# EAGLE design Dual-Port_microSD_Shield_USB2241 (EAGLE 9.6.2)
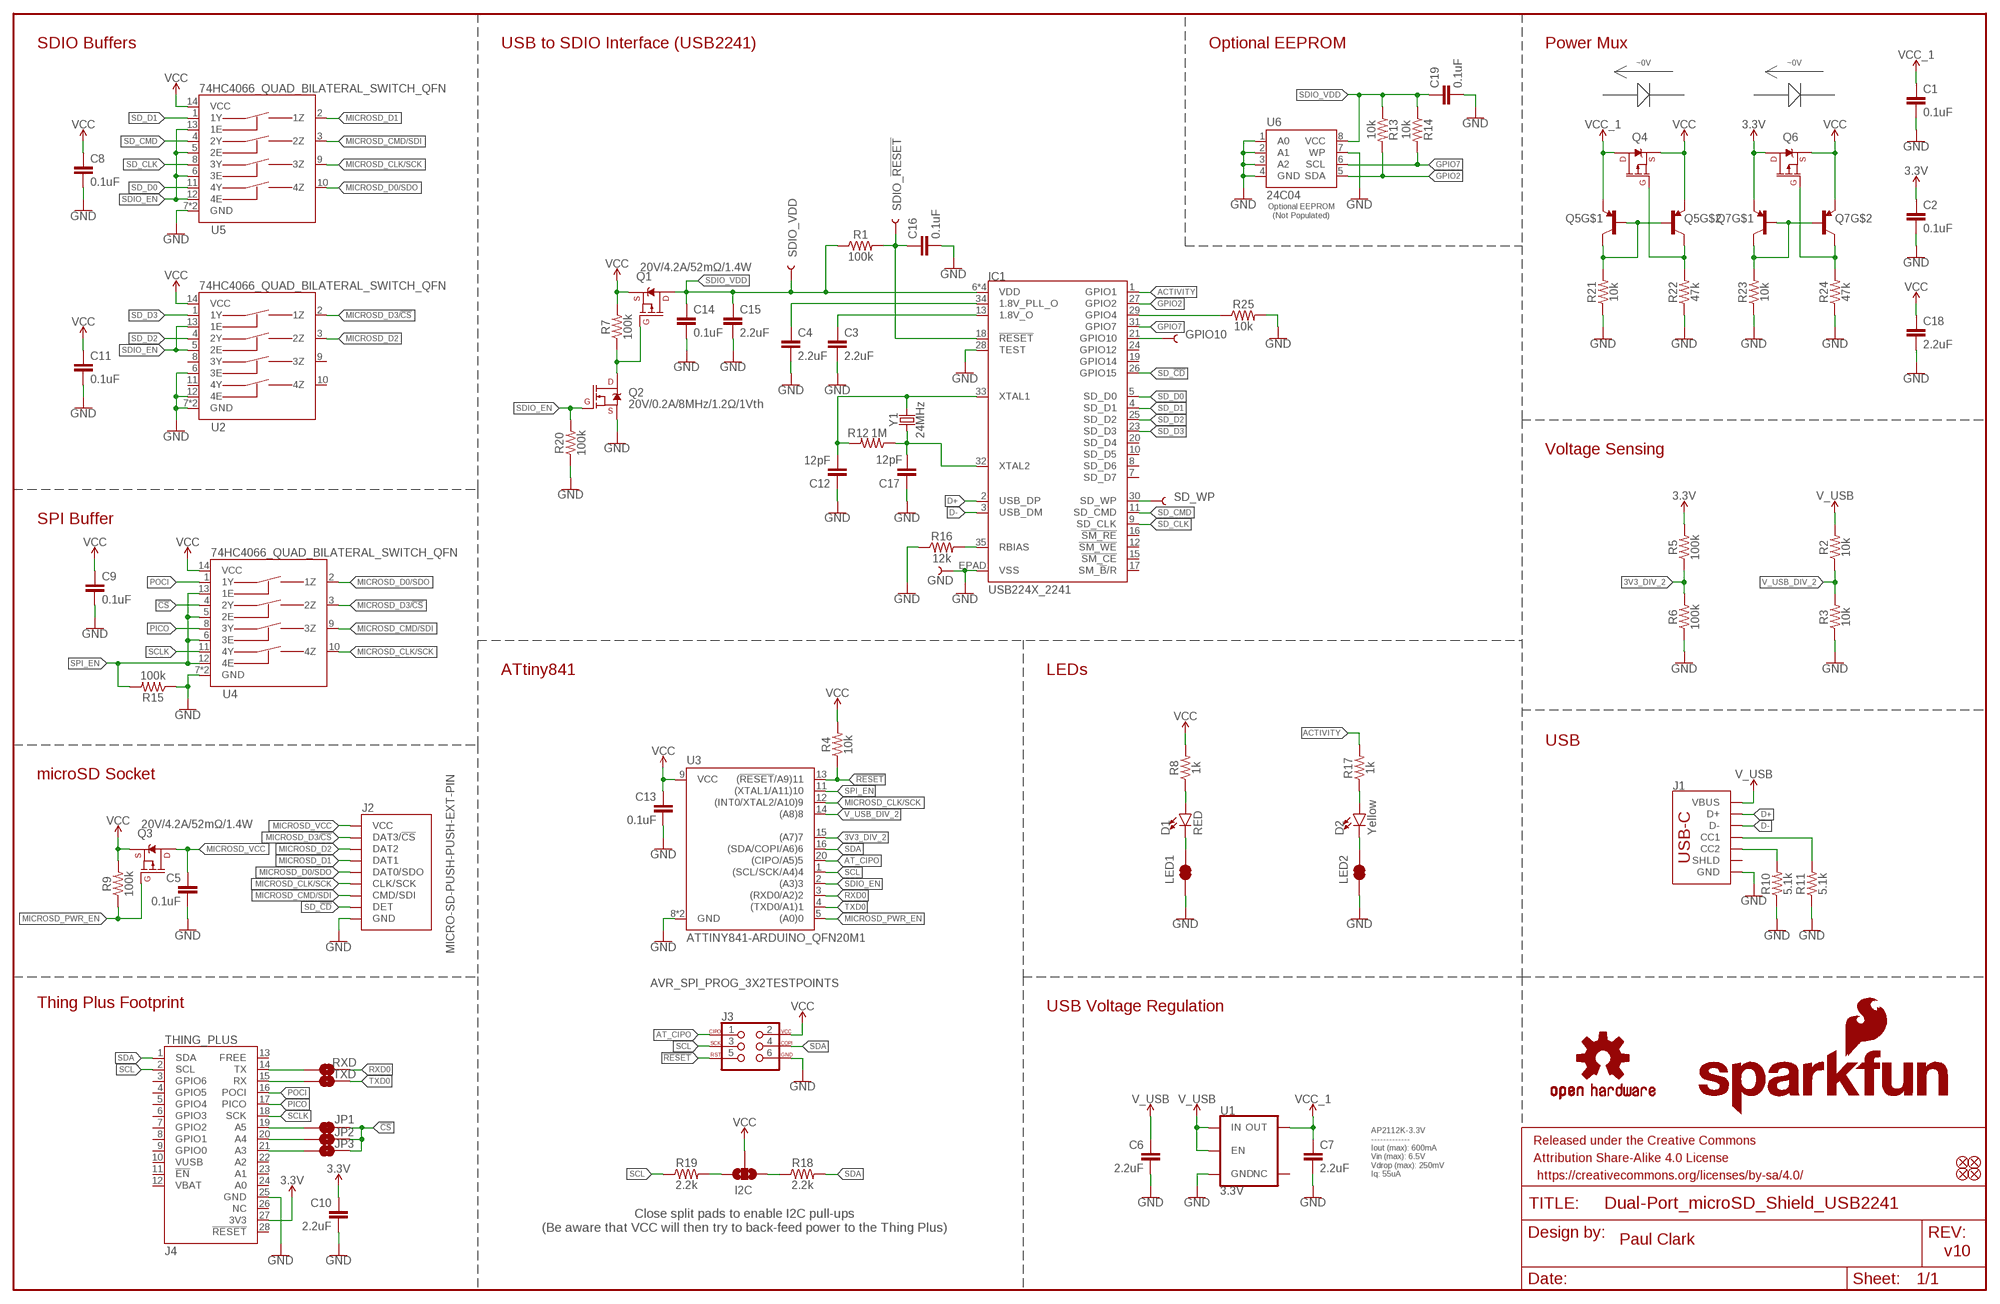
[diagram p0: schematic, sheet 1]

## Parts
C1  0.1uF  0.1UF-0402T-6.3V-10%-X7R  [0402-TIGHT]
C2  0.1uF  0.1UF-0402T-6.3V-10%-X7R  [0402-TIGHT]
C3  2.2uF  2.2UF-0402_TIGHT-10V-10%-X5R  [0402-TIGHT]
C4  2.2uF  2.2UF-0402_TIGHT-10V-10%-X5R  [0402-TIGHT]
C5  0.1uF  0.1UF-0402T-6.3V-10%-X7R  [0402-TIGHT]
C6  2.2uF  2.2UF-0402_TIGHT-10V-10%-X5R  [0402-TIGHT]
C7  2.2uF  2.2UF-0402_TIGHT-10V-10%-X5R  [0402-TIGHT]
C8  0.1uF  0.1UF-0402T-6.3V-10%-X7R  [0402-TIGHT]
C9  0.1uF  0.1UF-0402T-6.3V-10%-X7R  [0402-TIGHT]
C10  2.2uF  2.2UF-0402_TIGHT-10V-10%-X5R  [0402-TIGHT]
C11  0.1uF  0.1UF-0402T-6.3V-10%-X7R  [0402-TIGHT]
C12  12pF  12PF-0402T-50V-5%  [0402-TIGHT]
C13  0.1uF  0.1UF-0402T-6.3V-10%-X7R  [0402-TIGHT]
C14  0.1uF  0.1UF-0402T-6.3V-10%-X7R  [0402-TIGHT]
C15  2.2uF  2.2UF-0402_TIGHT-10V-10%-X5R  [0402-TIGHT]
C16  0.1uF  0.1UF-0402T-6.3V-10%-X7R  [0402-TIGHT]
C17  12pF  12PF-0402T-50V-5%  [0402-TIGHT]
C18  2.2uF  2.2UF-0402_TIGHT-10V-10%-X5R  [0402-TIGHT]
C19  0.1uF  0.1UF-0402T-6.3V-10%-X7R  [0402-TIGHT]
D1  RED  LED-RED0603  [LED-0603]
D2  Yellow  LED-YELLOW0603  [LED-0603]
FD1  FIDUCIALUFIDUCIAL  [FIDUCIAL-MICRO]
FD2  FIDUCIALUFIDUCIAL  [FIDUCIAL-MICRO]
FD3  FIDUCIALUFIDUCIAL  [FIDUCIAL-MICRO]
FD4  FIDUCIALUFIDUCIAL  [FIDUCIAL-MICRO]
FRAME1  FRAME-LEDGER  [CREATIVE_COMMONS]
GND  TEST-POINT3  [PAD.03X.03]
GPIO10  TEST-POINT3  [PAD.03X.03]
I2C  JUMPER-SMT_3_NO_SILK  [SMT-JUMPER_3_NO_SILK]
IC1  USB224X_2241  [36-QFN]
J1  USB_C_4-LAYER_PADS  [USB-C-16P_4LAYER-PADS]
J2  MICRO-SD-PUSH-PUSH-EXT-PIN  [MICROSD-EXTERNALPIN]
J3  AVR_SPI_PROG_3X2TESTPOINTS  [2X3_TEST_POINTS]
J4  THING_PLUS  [THING_PLUS]
JP1  JUMPER-SMT_2_NC_TRACE_SILK  [SMT-JUMPER_2_NC_TRACE_SILK]
JP2  JUMPER-SMT_2_NO_SILK  [SMT-JUMPER_2_NO_SILK]
JP3  JUMPER-SMT_2_NO_SILK  [SMT-JUMPER_2_NO_SILK]
LED1  JUMPER-SMT_2_NC_TRACE_SILK  [SMT-JUMPER_2_NC_TRACE_SILK]
LED2  JUMPER-SMT_2_NC_TRACE_SILK  [SMT-JUMPER_2_NC_TRACE_SILK]
LOGO2  OSHW-LOGOMINI  [OSHW-LOGO-MINI]
LOGO3  OSHW-LOGOMINI  [OSHW-LOGO-MINI]
LOGO4  SFE_LOGO_FLAME.2_INCH  [SFE_LOGO_FLAME_.2]
LOGO5  SFE_LOGO_NAME_FLAME.1_INCH  [SFE_LOGO_NAME_FLAME_.1]
Q1  20V/4.2A/52mΩ/1.4W  MOSFET_PCH-DMG2305UX-7  [SOT23-3]
Q2  20V/0.2A/8MHz/1.2Ω/1Vth  MOSFET-NCH-RE1C002UNTCL  [SOT-416FL]
Q3  20V/4.2A/52mΩ/1.4W  MOSFET_PCH-DMG2305UX-7  [SOT23-3]
Q4  20V/4.2A/52mΩ/1.4W  MOSFET_PCH-DMG2305UX-7  [SOT23-3]
Q5  TRANS_PNP_DUALSOT-363  [SOT363_PHILIPS]
Q6  20V/4.2A/52mΩ/1.4W  MOSFET_PCH-DMG2305UX-7  [SOT23-3]
Q7  TRANS_PNP_DUALSOT-363  [SOT363_PHILIPS]
R1  100k  100KOHM-0402T-1/16W-1%  [0402-TIGHT]
R2  10k  10KOHM-0402T-1/16W-1%  [0402-TIGHT]
R3  10k  10KOHM-0402T-1/16W-1%  [0402-TIGHT]
R4  10k  10KOHM-0402T-1/16W-1%  [0402-TIGHT]
R5  100k  100KOHM-0402T-1/16W-1%  [0402-TIGHT]
R6  100k  100KOHM-0402T-1/16W-1%  [0402-TIGHT]
R7  100k  100KOHM-0402T-1/16W-1%  [0402-TIGHT]
R8  1k  1KOHM-0402T-1/16W-1%  [0402-TIGHT]
R9  100k  100KOHM-0402T-1/16W-1%  [0402-TIGHT]
R10  5.1k  5.1KOHM-0402T-1/16W-1%  [0402-TIGHT]
R11  5.1k  5.1KOHM-0402T-1/16W-1%  [0402-TIGHT]
R12  1M  1MOHM-0402T-1/16W-5%  [0402-TIGHT]
R13  10k  10KOHM-0402T-1/16W-1%  [0402-TIGHT]
R14  10k  10KOHM-0402T-1/16W-1%  [0402-TIGHT]
R15  100k  100KOHM-0402T-1/16W-1%  [0402-TIGHT]
R16  12k  12KOHM-0603-1/10W-1%  [0603]
R17  1k  1KOHM-0402T-1/16W-1%  [0402-TIGHT]
R18  2.2k  2.2KOHM-0402T-1/16W-1%  [0402-TIGHT]
R19  2.2k  2.2KOHM-0402T-1/16W-1%  [0402-TIGHT]
R20  100k  100KOHM-0402T-1/16W-1%  [0402-TIGHT]
R21  10k  10KOHM-0402T-1/16W-1%  [0402-TIGHT]
R22  47k  47KOHM-0402-1/10W-1%  [0402-TIGHT]
R23  10k  10KOHM-0402T-1/16W-1%  [0402-TIGHT]
R24  47k  47KOHM-0402-1/10W-1%  [0402-TIGHT]
R25  10k  10KOHM-0402T-1/16W-1%  [0402-TIGHT]
RXD  JUMPER-SMT_2_NO_SILK  [SMT-JUMPER_2_NO_SILK]
SD_WP  TEST-POINT3  [PAD.03X.03]
SDIO_!RESET!  TEST-POINT3  [PAD.03X.03]
SDIO_VDD  TEST-POINT3  [PAD.03X.03]
TXD  JUMPER-SMT_2_NO_SILK  [SMT-JUMPER_2_NO_SILK]
U1  3.3V  V_REG_AP2112K-3.3V  [SOT23-5]
U2  74HC4066_QUAD_BILATERAL_SWITCH_QFN  [14-QFN]
U3  ATTINY841-ARDUINO_QFN20M1  [QFN20_20M1]
U4  74HC4066_QUAD_BILATERAL_SWITCH_QFN  [14-QFN]
U5  74HC4066_QUAD_BILATERAL_SWITCH_QFN  [14-QFN]
U6  24C04  EEPROM-I2C256K  [SO08]
Y1  24MHz  CRYSTAL-24MHZ-SMD-2.0X1.6MM  [CRYSTAL-SMD-2.0X1.6MM]

## Nets
3.3V: C2.1 C10.1 J4.27(3V3) Q6.3(D) Q7.1(E) R5.2
3V3_DIV_2: R5.1 R6.2 U3.15((A7)7)
!CS!: JP1.2 JP2.2 JP3.2 U4.4(2Y)
!RESET!: J3.5 R4.1 U3.13((!RESET!/A9)11)
ACTIVITY: IC1.1(GPIO1) R17.2
AT_CIPO: J3.1 U3.20((CIPO/A5)5)
D+: IC1.2(USB_DP) J1.A6(D+) J1.B6(D+)
D-: IC1.3(USB_DM) J1.A7(D-) J1.B7(D-)
GND: C1.2 C2.2 C3.2 C4.2 C5.2 C6.2 C7.2 C8.2 C9.2 C10.2 C11.2 C12.1 C13.2 C14.2 C15.2 C16.2 C17.1 C18.2 C19.2 GND.1 IC1.28(TEST) IC1.EPAD(VSS) J1.GND J1.GND2(GND) J2.6(GND) J2.10(GND) J2.11(GND) J2.12(GND) J2.13(GND) J3.6 J4.25(GND) LED1.1 LED2.1 Q2.2(S) R3.1 R6.1 R10.1 R11.1 R15.1 R16.1 R20.1 R21.1 R22.1 R23.1 R24.1 R25.2 U1.2(GND) U2.6(3E) U2.7(GND) U2.12(4E) U2.EPAD(GND) U3.8(GND) U3.PAD(GND) U4.7(GND) U4.EPAD(GND) U5.7(GND) U5.EPAD(GND) U6.1(A0) U6.2(A1) U6.3(A2) U6.4(GND) U6.7(WP)
GPIO2: IC1.27(GPIO2) R13.2 U6.5(SDA)
GPIO4: IC1.29(GPIO4) R25.1
GPIO7: IC1.31(GPIO7) R14.2 U6.6(SCL)
GPIO10: GPIO10.1 IC1.21(GPIO10)
MICROSD_CLK/SCK: J2.5(CLK/SCK) U3.12((INT0/XTAL2/A10)9) U4.10(4Z) U5.9(3Z)
MICROSD_CMD/SDI: J2.3(CMD/SDI) U4.9(3Z) U5.3(2Z)
MICROSD_D0/SDO: J2.7(DAT0/SDO) U4.2(1Z) U5.10(4Z)
MICROSD_D1: J2.8(DAT1) U5.2(1Z)
MICROSD_D2: J2.1(DAT2) U2.3(2Z)
MICROSD_D3/!CS!: J2.2(DAT3/!CS!) U2.2(1Z) U4.3(2Z)
MICROSD_PWR_EN: Q3.1(G) R9.1 U3.5((A0)0)
MICROSD_VCC: C5.1 J2.4(VCC) Q3.3(D)
N$1: J1.A5(CC1) R11.2
N$2: J1.B5(CC2) R10.2
N$3: C3.1 IC1.13(1.8V_O)
N$4: C4.1 IC1.34(1.8V_PLL_O)
N$5: Q5.2(B) Q5.5(B) Q5.6(C) R21.2
N$9: J4.19(A5) JP1.1
N$10: J4.20(A4) JP2.1
N$11: J4.21(A3) JP3.1
N$13: Q4.1(G) Q5.3(C) R22.2
N$14: I2C.3 R19.2
N$15: Q7.2(B) Q7.5(B) Q7.6(C) R23.2
N$16: I2C.1 R18.1
N$17: Q1.1(G) Q2.3(D) R7.1
N$18: D2.A R17.1
N$19: D2.C LED2.2
N$22: D1.A R8.1
N$23: IC1.35(RBIAS) R16.2
N$25: J4.14(TX) RXD.1
N$26: J4.15(RX) TXD.1
N$27: D1.C LED1.2
N$28: Q6.1(G) Q7.3(C) R24.2
PICO: J4.17(PICO) U4.8(3Y)
POCI: J4.16(POCI) U4.1(1Y)
RXD0: RXD.2 U3.3((RXD0/A2)2)
SCL: J3.3 J4.2(SCL) R19.1 U3.1((SCL/SCK/A4)4)
SCLK: J4.18(SCK) U4.11(4Y)
SD_!CD!: IC1.26(GPIO15) J2.9(DET)
SD_CLK: IC1.9(SD_CLK) U5.8(3Y)
SD_CMD: IC1.11(SD_CMD) U5.4(2Y)
SD_D0: IC1.5(SD_D0) U5.11(4Y)
SD_D1: IC1.4(SD_D1) U5.1(1Y)
SD_D2: IC1.25(SD_D2) U2.4(2Y)
SD_D3: IC1.23(SD_D3) U2.1(1Y)
SD_WP: IC1.30(SD_WP) SD_WP.1
SDA: J3.4 J4.1(SDA) R18.2 U3.16((SDA/COPI/A6)6)
SDIO_!RESET!: C16.1 IC1.18(!RESET!) R1.2 SDIO_!RESET!.1
SDIO_EN: Q2.1(G) R20.2 U2.5(2E) U2.13(1E) U3.2((A3)3) U5.5(2E) U5.6(3E) U5.12(4E) U5.13(1E)
SDIO_VDD: C14.1 C15.1 C19.1 IC1.6(VDD) IC1.14(VDD) IC1.22(VDD) IC1.36(VDD) Q1.3(D) R1.1 R13.1 R14.1 SDIO_VDD.1 U6.8(VCC)
SPI_EN: R15.2 U3.11((XTAL1/A11)10) U4.5(2E) U4.6(3E) U4.12(4E) U4.13(1E)
TXD0: TXD.2 U3.4((TXD0/A1)1)
V_USB: C6.1 J1.VBUS1(VBUS) J1.VBUS2(VBUS) R2.2 U1.1(IN) U1.3(EN)
V_USB_DIV_2: R2.1 R3.2 U3.14((A8)8)
VCC: C8.1 C9.1 C11.1 C13.1 C18.1 I2C.2 J3.2 Q1.2(S) Q3.2(S) Q4.2(S) Q5.4(E) Q6.2(S) Q7.4(E) R4.2 R7.2 R8.2 R9.2 U2.14(VCC) U3.9(VCC) U4.14(VCC) U5.14(VCC)
VCC_1: C1.1 C7.1 Q4.3(D) Q5.1(E) U1.5(OUT)
XTAL1: C12.2 IC1.33(XTAL1) R12.2 Y1.3
XTAL2: C17.2 IC1.32(XTAL2) R12.1 Y1.1
Unconnected: IC1.7(SD_D7) IC1.8(SD_D6) IC1.10(SD_D5) IC1.12(!SM_WE!) IC1.15(!SM_CE!) IC1.16(!SM_RE!) IC1.17(SM_!B!/R) IC1.19(GPIO14) IC1.20(SD_D4) IC1.24(GPIO12) J1.SHLD1(SHLD) J1.SHLD2(SHLD) J1.SHLD3(SHLD) J1.SHLD4(SHLD) J4.3(GPIO6) J4.4(GPIO5) J4.5(GPIO4) J4.6(GPIO3) J4.7(GPIO2) J4.8(GPIO1) J4.9(GPIO0) J4.10(VUSB) J4.11(!EN) J4.12(VBAT) J4.13(FREE) J4.22(A2) J4.23(A1) J4.24(A0) J4.26(NC) J4.28(!RESET) U1.4(NC) U2.8(3Y) U2.9(3Z) U2.10(4Z) U2.11(4Y)

## Notes on the sheet
- SDIO Buffers | USB to SDIO Interface (USB2241) | Optional EEPROM | Power Mux
- ~0V | ~0V
- Optional EEPROM
  (Not Populated)
- Voltage Sensing
- SPI Buffer
- ATtiny841 | LEDs
- USB
- microSD Socket
- Thing Plus Footprint | USB Voltage Regulation
- AP2112K-3.3V
  -------------
  Iout (max): 600mA 
  Vin (max): 6.5V
  Vdrop (max): 250mV
  Iq: 55uA
- Close split pads to enable I2C pull-ups
  (Be aware that VCC will then try to back-feed power to the Thing Plus)
- Paul Clark
- v10

## Library data of the parts
C1 C2 C5 C8 C9 C11 C13 C14 C16 C19 = SparkFun-Capacitors:0.1UF: 0.1µF ceramic capacitors A capacitor is a passive two-terminal electrical component used to store electrical energy temporarily in an electric field.; PROD_ID: CAP-14993
C3 C4 C6 C7 C10 C15 C18 = SparkFun-Capacitors:2.2UF: 2.2µF ceramic capacitors A capacitor is a passive two-terminal electrical component used to store electrical energy temporarily in an electric field.; PROD_ID: CAP-14232
C12 C17 = SparkFun-Capacitors:12PF: 12pF ceramic capacitors A capacitor is a passive two-terminal electrical component used to store electrical energy temporarily in an electric field.; PROD_ID: CAP-14665
D1 = SparkFun-LED:LED-RED: Red SMD LED Used in manufacturing of most products at SparkFun Packages: 0603 - SMD 0603 package [Product Link] <http://docs.avagotech.com/docs/AV02-0551EN> 0603 SMART - SMD 0603 SMART package ( more efficient and expensive)[Product Link] <http://www.osram-os.com/Graphics/XPic2/00077099_0.pdf> 1206 - SMD1206 package [Product Link] <https://www.sparkfun.com/datasheets/DevTools/LilyPad/Q150OVS4.pdff> SparkFun Products: Pro Mini 328 -5V <https://www.sparkfun.com/products/821> RedBoard <https://www.sparkfun.com/products/12757> IOIO-OTG <https://www.sparkfun.com/products/13613>; PROD_ID: DIO-00819
D2 = SparkFun-LED:LED-YELLOW: Yellow SMD LED Used in manufacturing several products at SparkFun. Packages: 0603 - SMD 0603 package[Product Link] <http://www.kingbrightusa.com/product.asp?catalog_name=LED&product_id=APT1608SYCK> 0603 -SMART - SMART SMD 0603 package (more efficient/more expensive) [Product Link] <http://www.osram-os.com/osram_os/en/products/product-catalog/led-light-emitting-diodes/smartled-0603/ly-l29k/index.jsp> LilyPad - SMD1206 package[Product Datasheet] <https://www.sparkfun.com/datasheets/DevTools/LilyPad/Q150YUS4.pdf> SparkFun Products: Blynk Board <https://www.sparkfun.com/products/13794> IOIO-OTG <https://www.sparkfun.com/products/13613> XBee Explorer Serial <https://www.sparkfun.com/products/13225>; PROD_ID: DIO-09003
FD1-FD4 = SparkFun-Aesthetics:FIDUCIAL: Fiducial Alignment Points Point-of-reference for pick-and-place machines and other optical instruments.
FRAME1 = SparkFun-Aesthetics:FRAME-LEDGER: Schematic Frame - Ledger Standard 11x14 US Ledger frame
GND GPIO10 SD_WP SDIO_!RESET! SDIO_VDD = SparkFun-Connectors:TEST-POINT: SparkFun Test Points Bare copper test points for troubleshooting or In-Circuit-Testing. These are used by our Production team for verifying production board runs using pogo-pins on test beds. SparkFun Products: SparkFun LSM9DS1 Breakout <https://www.sparkfun.com/products/13284> SparkFun PSOC <https://www.sparkfun.com/products/13714> SparkFun Load Cell Amplifier <https://www.sparkfun.com/products/13879>
I2C = SparkFun-Jumpers:JUMPER-SMT_3_NO: Normally open jumper This jumper has three pads in close proximity to each other. Apply solder to close the connection(s).
IC1 = USB224x:USB224X: Microchip Technology USB224x Flash Media Controller 36-QFN Source: Datasheet <https://ww1.microchip.com/downloads/en/DeviceDoc/00001979A.pdf>
J1 = SparkFun-Connectors:USB_C: USB Type C 16Pin Connector Super Speed pins not available on the 16-pin purely SMD connector so this part is best for USB 2.0 implementations. D1 and D2 are tied together enabling D+/- no matter which way the cable is plugged into the connector. The two channel configuration pins (CC1/2) are exposed. These are normally connected to ground via 5.1k resistors but can be reconfigured for high current/high power applications. **4-LAYER BOARD WARNING!!** If designing 4-layer board, make sure to select the variant _4-LAYER-ISOLATED. The linked footprint (USB-C-16-4LAYER-ISOLATED) includes some very necessary cutout polygons in the inner layers (2 and 15). This prevents the PTH mounting shield legs on the USB connector from electrically connecting any other polygons on the inner layers (usually VCC and GND).; PROD_ID: CONN-14122
J2 = SparkFun-Connectors:MICRO-SD: microSD Socket for Transflash Various sockets for µSD. tDoc lines correctly indicate media card edge positions when inserting (unlocked, locked, depressed). NOTE: CD1 and CD2 are connected internally, and the default detect state of the socket is detect pin to ground. SparkFun Products: WAV Trigger <https://www.sparkfun.com/products/13660> CAN-Bus Shield <https://www.sparkfun.com/products/13262> SparkFun Level Shifing microSD Breakout <https://www.sparkfun.com/products/13743>; PROD_ID: CONN-16110
J3 = SparkFun-Connectors:AVR_SPI_PROG_3X2: AVR ISP 6 Pin This is the reduced ISP connector for AVR programming. Common on Arduino. This footprint will take up less PCB space and can be used with a 10-pin to 6-pin adapter such as SKU: BOB-08508 **Special note about "TEST_POINT" package. The stop mask is on the top side, so if you want your programming test points to be on the bottom of your board, make sure to place this package on the bottom side of the board. This also ensure that the orientation to program from the bottom side will be correct. SparkFun Products: SparkFun ISP Pogo Adapter <https://www.sparkfun.com/products/11591> - NS Tiny AVR Programmer <https://www.sparkfun.com/products/11801> -PTH
J4 = Thing_Plus:THING_PLUS
JP1 LED1 LED2 = SparkFun-Jumpers:JUMPER-SMT_2_NC_TRACE: Normally closed trace jumper This jumper has a trace between two pads so it's normally closed (NC). Use a razor knife to open the connection. For best results follow the IPC guidelines for cutting traces: Cutout at least 0.063 mm (0.005 in). Remove all loose material to clean up the cut area. Seal the cut with an approved epoxy. Reapply solder to reclose the connection.
JP2 JP3 RXD TXD = SparkFun-Jumpers:JUMPER-SMT_2_NO: Normally open jumper This jumper has two pads in close proximity to each other. Apply solder to close the connection. Round pads are easier to solder for beginners, but are a lot larger. SparkFun Product that uses the round pads: SparkFun EL Sequencer <https://www.sparkfun.com/products/12781>
LOGO2 LOGO3 = SparkFun-Aesthetics:OSHW-LOGO: Open-Source Hardware (OSHW) Logo This logo indicates the piece of hardware it is found on incorporates a OSHW license and/or adheres to the definition of open source hardware found here: http://freedomdefined.org/OSHW
LOGO4 = SparkFun-Aesthetics:SFE_LOGO_FLAME: SparkFun Flame Logo This is the SparkFun flame logo. The logo on the schematic will always be the same size; the package variant is the height of the flame. Default layer for the logo on the board is tSilk.
LOGO5 = SparkFun-Aesthetics:SFE_LOGO_NAME_FLAME: SparkFun Font Logo w/ Flame This is the SparkFun full logo. The logo on the schematic will always be the same size; the package variant is the height of the flame part of the logo. Default layer for the logo on the board is tSilk.
Q1 Q3 Q4 Q6 = SparkFun-DiscreteSemi:MOSFET_PCH: P-channel MOSFETs Voltage controlled devices that allow control of high current outputs. SparkFun Products: SparkFun ESP32 Thing <https://www.sparkfun.com/products/13907> SparkFun ESP8266 Thing <https://www.sparkfun.com/products/13231> SparkFun Pi Servo HAT V2 <https://www.sparkfun.com/products/15316> DMG2305UX-7 (20V/4.2A/SOT23-3); PROD_ID: TRANS-14388
Q2 = SparkFun-DiscreteSemi:MOSFET-NCH: N-channel MOSFETs Voltage controlled devices that allow control of high current outputs. SparkFun Products: SparkFun OpenScale <https://www.sparkfun.com/products/13261> SparkFun Digital Sandbox <https://www.sparkfun.com/products/12651> SparkFun Monster Moto Shield <https://www.sparkfun.com/products/10182> SparkFun MOSFET Power Controller <https://www.sparkfun.com/products/11214>; PROD_ID: TRANS-14399
Q5 Q7 = SparkFun-DiscreteSemi:TRANS_PNP_DUAL: Dual PNP Transistors in Single Package The BCM857BS puts two PNP transistors in a single package. Bipolar (BJT) Transistor Array 2 PNP (Dual) 45V 100mA 100MHz 200mW Surface Mount SOT-363 Datasheet <https://www.diodes.com/assets/Datasheets/BCM857BS.pdf> SparkFun Products: SparkFun Pi Servo HAT V2 <https://www.sparkfun.com>; PROD_ID: TRANS-14386
R1 R5-R7 R9 R15 R20 = SparkFun-Resistors:100KOHM: 100kΩ resistor A resistor is a passive two-terminal electrical component that implements electrical resistance as a circuit element. Resistors act to reduce current flow, and, at the same time, act to lower voltage levels within circuits. - Wikipedia; PROD_ID: RES-13495
R2-R4 R13 R14 R21 R23 R25 = SparkFun-Resistors:10KOHM: 10kΩ resistor A resistor is a passive two-terminal electrical component that implements electrical resistance as a circuit element. Resistors act to reduce current flow, and, at the same time, act to lower voltage levels within circuits. - Wikipedia; PROD_ID: RES-14241
R8 R17 = SparkFun-Resistors:1KOHM: 1kΩ resistor A resistor is a passive two-terminal electrical component that implements electrical resistance as a circuit element. Resistors act to reduce current flow, and, at the same time, act to lower voltage levels within circuits. - Wikipedia; PROD_ID: RES-14342
R10 R11 = SparkFun-Resistors:5.1KOHM; PROD_ID: RES-14340
R12 = SparkFun-Resistors:1MOHM: 1MΩ resistor A resistor is a passive two-terminal electrical component that implements electrical resistance as a circuit element. Resistors act to reduce current flow, and, at the same time, act to lower voltage levels within circuits. - Wikipedia; PROD_ID: RES-15185
R16 = SparkFun-Resistors:12KOHM: 12kΩ resistor A resistor is a passive two-terminal electrical component that implements electrical resistance as a circuit element. Resistors act to reduce current flow, and, at the same time, act to lower voltage levels within circuits. - Wikipedia; PROD_ID: RES-10327
R18 R19 = SparkFun-Resistors:2.2KOHM: 2.2kΩ resistor A resistor is a passive two-terminal electrical component that implements electrical resistance as a circuit element. Resistors act to reduce current flow, and, at the same time, act to lower voltage levels within circuits. - Wikipedia; PROD_ID: RES-14341
R22 R24 = SparkFun-Resistors:47KOHM: 47kΩ resistor A resistor is a passive two-terminal electrical component that implements electrical resistance as a circuit element. Resistors act to reduce current flow, and, at the same time, act to lower voltage levels within circuits. - Wikipedia; PROD_ID: RES-15011
U1 = SparkFun-IC-Power:V_REG_AP2112: AP2112 - 600mA CMOS LDO Regulator w/ Enable The AP2112 is CMOS process low dropout linear regulator with enable function, the regulator delivers a guaranteed 600mA (min.) continuous load current. Features Output Voltage Accuracy: ±1.5% Output Current: 600mA (Min.) Foldback Short Current Protection: 50mA Enable Function to Turn ON/OFF VOUT Low Dropout Voltage (3.3V): 250mV (Typ.) @IOUT=600mA Excellent Load Regulation: 0.2%/A (Typ.) Excellent Line Regulation: 0.02%/V (Typ.) Low Quiescent Current: 55μA (Typ.) Low Standby Current: 0.01μA (Typ.) Low Output Noise: 50μVRMS PSRR: 100Hz -65dB, 1kHz -65dB OTSD Protection Stable with 1.0μF Flexible Cap: Ceramic, Tantalum and Aluminum Electrolytic Operation Temperature Range: -40°C to 85°C ESD: MM 400V, HBM 4000V; PROD_ID: VREG-12457
U2 U4 U5 = 74HC4066:74HC4066_QUAD_BILATERAL_SWITCH: Nexperia Quad Bilateral Switch The 74HC4066 is a quad single pole, single throw analog switch. Each switch features two input/output terminals (nY and nZ) and an active HIGH enable input (nE). When nE is LOW, the analog switch is turned off. Inputs include clamp diodes. This enables the use of current limiting resistors to interface inputs to voltages in excess of VCC. Datasheet <https://assets.nexperia.com/documents/data-sheet/74HC_HCT4066.pdf>
U3 = SparkFun-IC-Microcontroller:ATTINY841-ARDUINO: ATtiny841; DIGIKEY_PART: ATTINY841-MU-ND; PROD_ID: IC-16067
U6 = SparkFun-IC-Memory:EEPROM-I2C: I2C EEPROMs, 24LC256 and others 24LC256 Series 256 kb I2C 2 Wire (32 k x 8 Bit) 2.5 V Serial EEPROM SMD - SOIC-8 Datasheet SparkFun Products SparkFun UDB5 - PIC UAV Development Board <https://www.sparkfun.com/products/11703> (GPS-11703); PROD_ID: IC-09714; VALUE: 24LC256
Y1 = SparkFun-Clocks:CRYSTAL-24MHZ: 24MHz Crystal Datasheet <http://www.sparkfun.com/datasheets/Components/AT-SMD-5x3.pdf> Frequency: 24MHz Frequency Tolerance: ±20ppm Load Capacitance: 12pF SparkFun Products: USB Bit Whacker <https://www.sparkfun.com/products/762>; PROD_ID: XTAL-14845

## Net classes
1 Power: width 0.305 mm
2 3.3V: width 0.508 mm

## Board
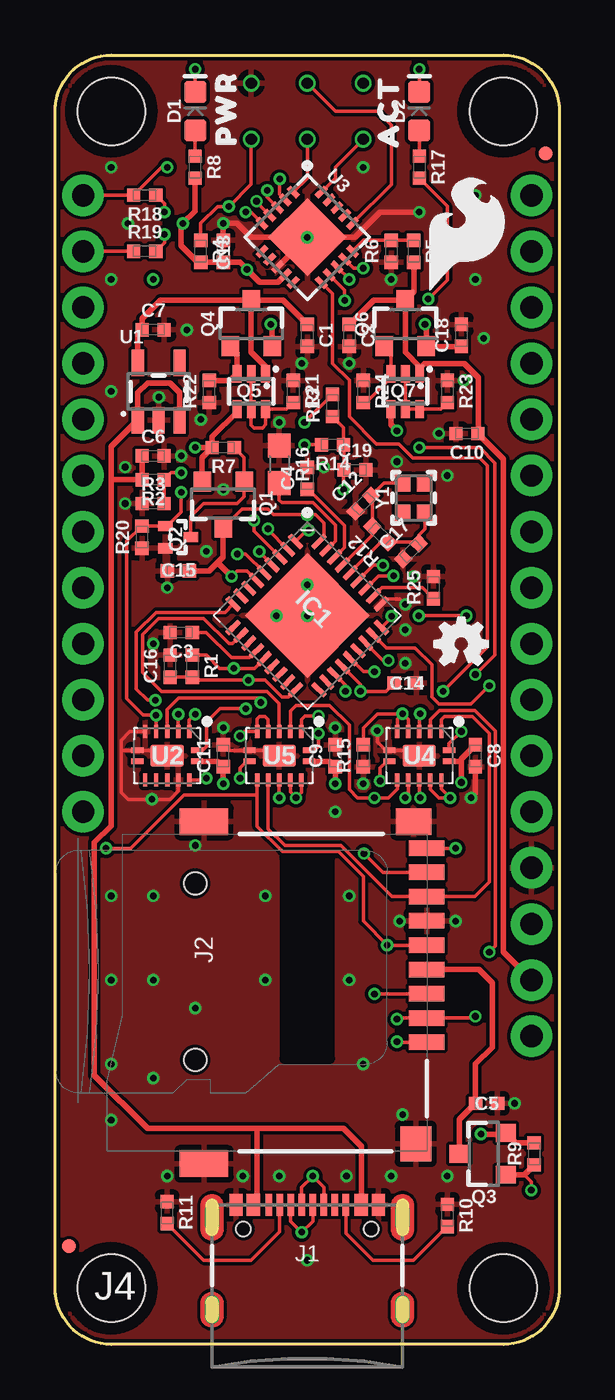
[diagram p1: board, top side]
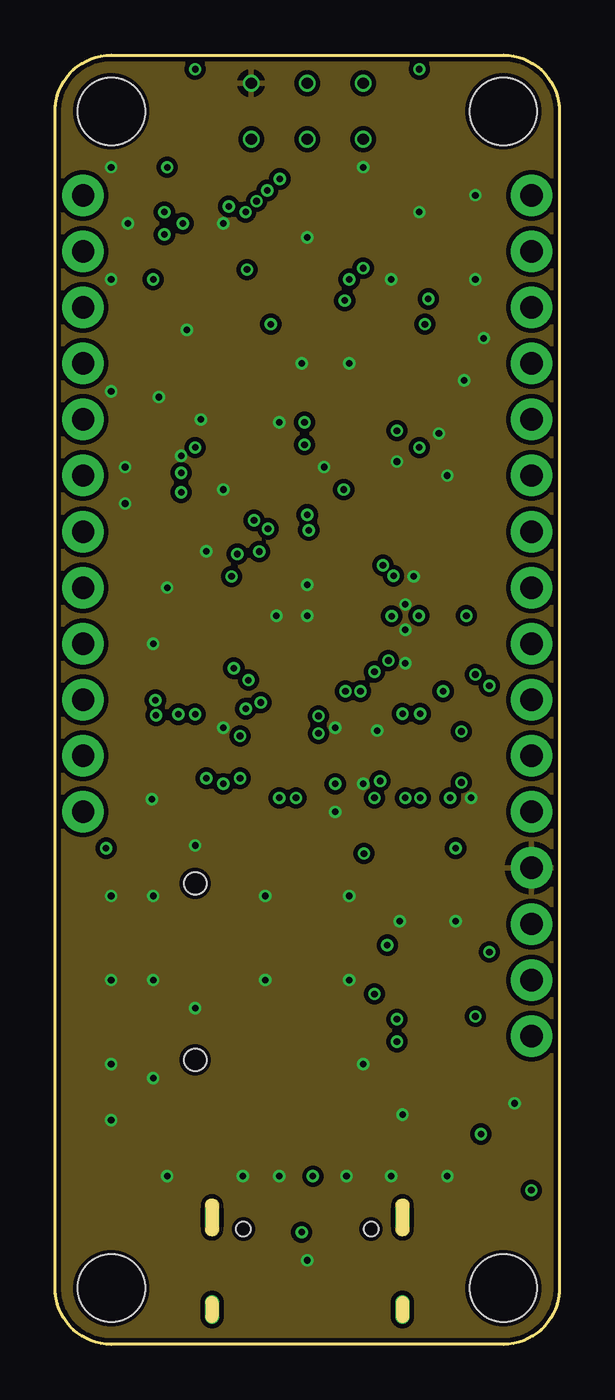
[diagram p2: board, inner layer Route2]
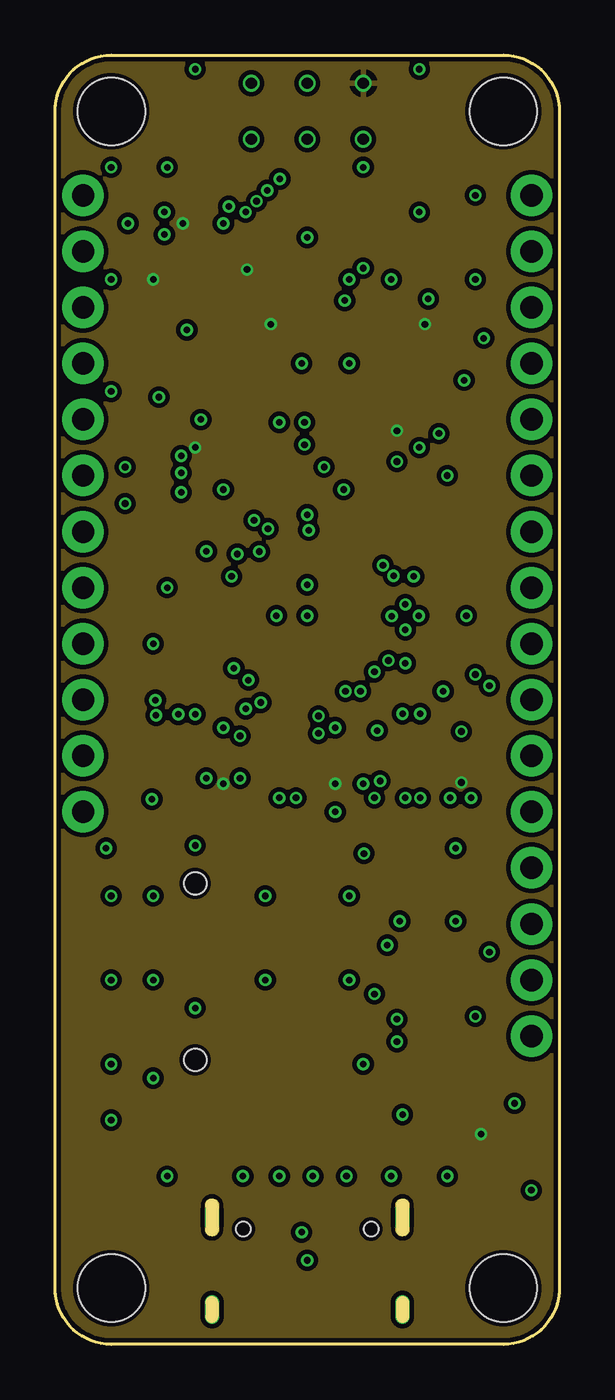
[diagram p3: board, inner layer Route15]
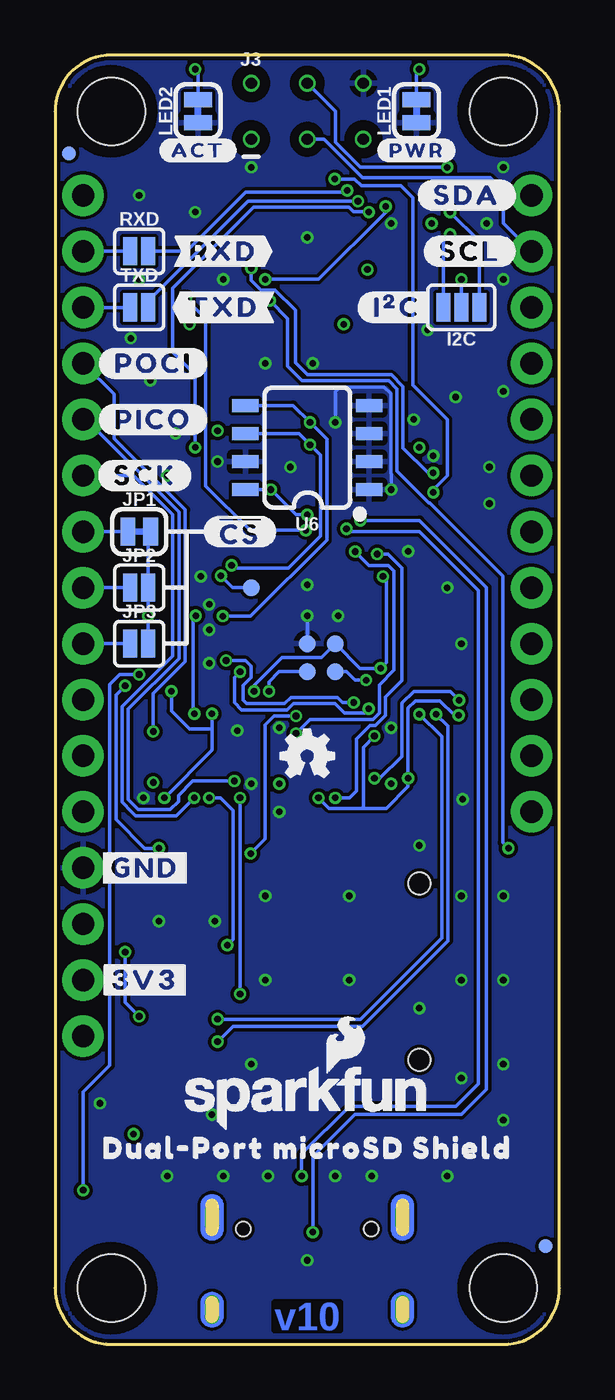
[diagram p4: board, bottom side, seen from below]

Size 22.86 x 58.42 mm. Coordinates in mm from the lower left corner, seen from the top.
Copper layers (1*2*15*16): Top 0.035559375mm / dielectric 0.47751875mm / Route2 0.035559375mm / dielectric 0.47751875mm / Route15 0.035559375mm / dielectric 0.47751875mm / Bottom 0.035559375mm
Design rules "SparkFun-4-Layer-Minimum-JLCPCB": minimum track width 5mil, minimum drill 0.2mm, track to track 5mil, track to pad 5mil, pad to pad 5mil, via to via 5mil, smd to smd 5mil, copper to edge 7mil, drill to drill 7mil, minimum pad ring 5mil, minimum via ring 5mil, stop-mask expansion 2.5mil, vias tented up to drill 25mil, thermal gap 10mil
tRestrict: area 10.4,13 to 12.4,22
bRestrict: area 8.3,54 to 9.5,55.2; area 13.3,54 to 14.6,55.2; area 13.3,56.5 to 14.6,57.8; 2 lines

### Footprints (pad centres in the part's own frame; a part is rotated, then mirrored left to right if it is on the bottom)
0402-TIGHT = smd 0.6 x 0.6: 1 -0.5,0; 2 0.5,0
LED-0603 = smd 1 x 1: A -0.877,0; C 0.877,0
FIDUCIAL-MICRO = smd 0.635 x 0.635: 1 0,0
PAD.03X.03 = smd 0.762 x 0.762: 1 0,0
SMT-JUMPER_3_NO_SILK = smd 0.635 x 1.27: 1 -0.813,0; 2 0,0; 3 0.813,0
36-QFN = smd 0.8 x 0.25: 1 -2.75,2; 2 -2.75,1.5; 3 -2.75,1; 4 -2.75,0.5; 5 -2.75,0; 6 -2.75,-0.5; 7 -2.75,-1; 8 -2.75,-1.5; 9 -2.75,-2; 19 2.75,-2; 20 2.75,-1.5; 21 2.75,-1; 22 2.75,-0.5; 23 2.75,0; 24 2.75,0.5; 25 2.75,1; 26 2.75,1.5; 27 2.75,2 | smd 0.25 x 0.8: 10 -2,-2.75; 11 -1.5,-2.75; 12 -1,-2.75; 13 -0.5,-2.75; 14 0,-2.75; 15 0.5,-2.75; 16 1,-2.75; 17 1.5,-2.75; 18 2,-2.75; 28 2,2.75; 29 1.5,2.75; 30 1,2.75; 31 0.5,2.75; 32 0,2.75; 33 -0.5,2.75; 34 -1,2.75; 35 -1.5,2.75; 36 -2,2.75 | smd 4 x 4: EPAD 0,0
USB-C-16P_4LAYER-PADS = smd 0.3 x 1: A5 -1.25,-0.34; A6 -0.25,-0.34; A7 0.25,-0.34; A8 1.25,-0.34; B5 1.75,-0.34; B6 0.75,-0.34; B7 -0.75,-0.34; B8 -1.75,-0.34 | smd 0.6 x 1: GND -3.225,-0.34; GND2 3.225,-0.34; VBUS1 -2.45,-0.34; VBUS2 2.45,-0.34 | drill 0.4 pad 0.6 long: SHLD1 -4.318,-0.915; SHLD2 4.318,-0.915; SHLD3 -4.318,-5.095; SHLD4 4.318,-5.095 | hole 0.65: -2.89,-1.445; 2.89,-1.445
MICROSD-EXTERNALPIN = smd 0.7 x 1.6: 1 2.25,10.5; 2 1.15,10.5; 3 0.05,10.5; 4 -1.05,10.5; 5 -2.15,10.5; 6 -3.25,10.5; 7 -4.35,10.5; 8 -5.45,10.5; 9 -6.55,10.5 | smd 1.2 x 1.6: 10 -7.75,9.9 | smd 1.2 x 2.2: 11 -7.75,0.4; 12 7.75,0.4 | smd 1.6 x 1.4: 13 6.85,10 | hole 1: 3.05,0; -4.95,0
2X3_TEST_POINTS = drill 0.508: 1 -2.54,-1.27; 2 -2.54,1.27; 3 0,-1.27; 4 0,1.27; 5 2.54,-1.27; 6 2.54,1.27
THING_PLUS = drill 1.016 pad 1.88: 1 1.27,52.07; 2 1.27,49.53; 3 1.27,46.99; 4 1.27,44.45; 5 1.27,41.91; 6 1.27,39.37; 7 1.27,36.83; 8 1.27,34.29; 9 1.27,31.75; 10 1.27,29.21; 11 1.27,26.67; 12 1.27,24.13; 13 21.59,52.07; 14 21.59,49.53; 15 21.59,46.99; 16 21.59,44.45; 17 21.59,41.91; 18 21.59,39.37; 19 21.59,36.83; 20 21.59,34.29; 21 21.59,31.75; 22 21.59,29.21; 23 21.59,26.67; 24 21.59,24.13; 25 21.59,21.59; 26 21.59,19.05; 27 21.59,16.51; 28 21.59,13.97 | hole 3.048: 2.54,2.54; 2.54,55.88; 20.32,2.54; 20.32,55.88
SMT-JUMPER_2_NC_TRACE_SILK = smd 0.66 x 1.27: 1 -0.521,0; 2 0.521,0
SMT-JUMPER_2_NO_SILK = smd 0.635 x 1.27: 1 -0.406,0; 2 0.406,0
SOT23-3 = smd 0.8 x 0.9: 1 -0.95,-1; 2 0.95,-1; 3 0,1.1
SOT-416FL = smd 0.46 x 0.65: 1 -0.5,-1.1; 2 0.5,-1.1; 3 0,0.05
SOT363_PHILIPS = smd 0.4 x 0.8: 1 -0.65,-0.8; 2 0,-0.8; 3 0.65,-0.8; 4 0.65,0.8; 5 0,0.8; 6 -0.65,0.8
0603 = smd 1.1 x 1: 1 -0.85,0; 2 0.85,0
SOT23-5 = smd 0.55 x 1.2: 1 -0.95,-1.3; 2 0,-1.3; 3 0.95,-1.3; 4 0.95,1.3; 5 -0.95,1.3
14-QFN = smd 0.25 x 0.6: 1 -0.25,1.35; 7 -0.25,-1.35; 8 0.25,-1.35; 14 0.25,1.35 | smd 0.6 x 0.25: 2 -1.1,1; 3 -1.1,0.5; 4 -1.1,0; 5 -1.1,-0.5; 6 -1.1,-1; 9 1.1,-1; 10 1.1,-0.5; 11 1.1,0; 12 1.1,0.5; 13 1.1,1 | smd 1 x 1.5: EPAD 0,0
QFN20_20M1 = smd 0.6 x 0.25: 1 -1.9,1; 2 -1.9,0.5; 3 -1.9,0; 4 -1.9,-0.5; 5 -1.9,-1; 11 1.9,-1; 12 1.9,-0.5; 13 1.9,0; 14 1.9,0.5; 15 1.9,1 | smd 0.25 x 0.6: 6 -1,-1.9; 7 -0.5,-1.9; 8 0,-1.9; 9 0.5,-1.9; 10 1,-1.9; 16 1,1.9; 17 0.5,1.9; 18 0,1.9; 19 -0.5,1.9; 20 -1,1.9 | smd 2.5 x 2.5: PAD 0,0
SO08 = smd 0.6 x 1.2: 1 -1.905,-2.8; 2 -0.635,-2.8; 3 0.635,-2.8; 4 1.905,-2.8; 5 1.905,2.8; 6 0.635,2.8; 7 -0.635,2.8; 8 -1.905,2.8
CRYSTAL-SMD-2.0X1.6MM = smd 0.75 x 0.7: 1 -0.675,-0.5; 2 0.675,-0.5; 3 0.675,0.5; 4 -0.675,0.5

### Placement (x,y rotation side)
C1  11.43,45.72 270 top
C2  13.34,45.72 270 top
C3  5.71,32.26 180 top
C4  11.43,39.24 90 top
C5  19.56,10.92 0 top
C6  4.45,40.26 0 top
C7  4.45,45.97 0 top
C8  19.05,26.67 270 top
C9  12.7,26.67 90 top
C10  18.67,41.27 180 top
C11  7.62,26.67 90 top
C12  13.97,38.1 45 top
C13  7.62,49.53 90 top
C14  15.88,29.97 0 top
C15  5.59,35.05 180 top
C16  5.21,30.73 90 top
C17  16.13,35.94 45 top
C18  18.41,45.72 90 top
C19  13.59,39.62 0 top
D1  6.35,55.88 90 top
D2  16.51,55.88 90 top
FD1  22.23,53.98 0 top
FD2  0.64,4.45 0 bottom
FD3  0.64,4.45 0 top
FD4  22.23,53.98 0 bottom
FRAME1  64.77,-2.54 0 top  (outside the outline)
GND  11.43,31.75 0 bottom
GPIO10  11.43,30.48 0 bottom
I2C  4.45,46.99 180 bottom
IC1  11.43,33.02 315 top
J1  11.43,6.67 0 top
J2  6.35,15.94 270 top
J3  11.43,55.88 0 bottom
J4  0,0 0 top
JP1  19.05,36.83 0 bottom
JP2  19.05,34.29 0 bottom
JP3  19.05,31.75 0 bottom
LED1  6.48,55.88 90 bottom
LED2  16.38,55.88 90 bottom
LOGO1  SPECIAL_INSTRUCTIONS-ORDERING  [ORDERING_INSTRUCTIONS]  34.29,58.42 0 top  (outside the outline)
LOGO2  18.41,31.75 0 top
LOGO3  11.43,26.67 0 bottom
LOGO4  18.67,50.29 0 top
LOGO5  11.43,11.18 0 bottom
Q1  7.62,38.1 180 top
Q2  6.1,36.58 270 top
Q3  19.43,8.64 90 top
Q4  8.89,46.23 0 top
Q5  8.89,43.18 180 top
Q6  15.88,46.23 0 top
Q7  15.88,43.18 180 top
R1  6.22,30.73 270 top
R2  4.45,39.18 180 top
R3  4.45,38.1 0 top
R4  6.6,49.53 270 top
R5  16.26,49.53 270 top
R6  15.24,49.53 90 top
R7  7.62,40.64 180 top
R8  6.35,53.34 270 top
R9  21.72,8.64 90 top
R10  17.78,5.84 270 top
R11  5.08,5.97 270 top
R12  14.73,36.7 135 top
R13  12.57,42.55 90 top
R14  12.57,40.77 180 top
R15  13.97,26.67 90 top
R16  10.16,39.88 270 top
R17  16.51,53.34 270 top
R18  4.06,52.07 180 top
R19  4.06,49.53 0 top
R20  3.94,36.58 90 top
R21  10.79,43.18 270 top
R22  6.99,43.18 90 top
R23  17.78,43.18 270 top
R24  13.97,43.18 270 top
R25  17.14,34.29 90 top
RXD  19.05,49.53 0 bottom
SD_WP  13.97,34.29 0 bottom
SDIO_!RESET!  10.16,30.48 0 bottom
SDIO_VDD  10.16,31.75 0 bottom
TXD  19.05,46.99 0 bottom
U1  4.7,43.18 0 top
U2  5.08,26.67 270 top
U3  11.43,50.16 315 top
U4  16.51,26.67 270 top
U5  10.16,26.67 270 top
U6  11.43,40.64 90 bottom
U$1  [#SDA#0]  4.19,52.07 0 bottom
U$2  [#SCL#0]  4.06,49.53 0 bottom
U$3  [#POCI#0]  18.41,44.45 0 bottom
U$4  [#PICO#0]  18.41,41.91 0 bottom
U$5  [#SCK#0]  18.8,39.37 0 bottom
U$7  [#GND#0]  18.8,21.59 0 bottom
U$8  [#3V3#0]  18.8,16.51 0 bottom
U$9  [#RXD#0]  15.24,49.53 0 bottom
U$10  [#TXD#0]  15.24,46.99 0 bottom
U$11  [PWR0]  7.75,56.01 90 top
U$12  [ACT0]  15.11,55.88 90 top
U$13  [#I�C#0]  7.37,46.99 0 bottom
U$14  [DUAL#PORT_MICROSD_SHIELD0]  11.43,8.89 0 bottom
U$15  [#PWR#0]  6.48,54.1 0 bottom
U$16  [#ACT#0]  16.38,54.1 0 bottom
U$17  [##CS##0]  14.48,36.83 0 bottom
Y1  16.26,38.35 90 top

### Tracks (layer width: path | path; a pad name or v marks a point on that pad's centre or on a via)
3.3V
  Top 0.254: J4.27 20.32,17.78 20.32,40.12 C10.1 19.18,41.28 19.18,43.81 18.54,44.45 16.74,44.45 16.52,44.23 Q7.1 16.52,44.31 15.88,44.96 Q6.3 | C2.1 14.44,47.33 Q6.3 | R5.2 16.26,47.71 Q6.3
3V3_DIV_2
  Top 0.152: R5.1 R6.2 13.98,50.03 U3.15
!CS!  (via drill 0.3)
  Top 0.152: v16.49,33.02 v18.64,33.02 | U4.4 16.51,28.54 v16.55,28.58
  Bottom 0.152: JP3.2 v18.64,33.02 JP2.2 18.64,36.72 JP1.2 | v16.55,28.58 16.61,28.64 16.61,32.89 v16.49,33.02
!RESET!  (via drill 0.3)
  Top 0.152: U3.13 v13.34,48.26 | v13.34,48.26 | J3.5 8.89,52.58 v7.87,51.56 7.37,51.56 6.6,50.8 R4.1
  Bottom 0.152: v13.34,48.26 10.92,48.26 7.87,51.31 v7.87,51.56
ACTIVITY  (via drill 0.3)
  Top 0.152: R17.2 17.78,51.57 17.78,48.23 v16.92,47.37 | IC1.1 11.41,36.89 v11.49,36.89
  Bottom 0.152: v16.92,47.37 16.03,46.48 16.03,38.89 14.03,36.89 v11.49,36.89
AT_CIPO
  Top 0.152: U3.20 12.7,52.85 12.7,53.34 J3.1
D+  (via drill 0.3)
  Top 0.152: J1.A6 11.18,7.12 v11.68,7.62 12.18,7.12 J1.B6 | IC1.2 9.65,36.92 v9.65,36.96
  Bottom 0.152: v11.68,7.62 11.68,8.64 9.53,10.79 4.7,10.79 3.68,11.81 3.68,34.16 6.35,36.83 9.53,36.83 v9.65,36.96
D-  (via drill 0.3)
  Top 0.152: J1.B7 10.68,5.58 v11.18,5.08 11.68,5.58 J1.A7 | IC1.3 9.02,36.85 v9.02,37.34
  Bottom 0.152: v9.02,37.34 6.34,37.34 3.3,34.3 3.3,11.56 4.45,10.41 9.27,10.41 11.18,8.51 v11.18,5.08
GND  (via drill 0.3)
  Top 0.152: U2.EPAD 4.83,26.92 U2.7 2.99,26.92 2.98,26.92 | IC1.28 15.02,33.78 15.62,33.78 v15.88,33.53 | U5.EPAD 9.91,26.92 U5.7 7.87,26.92 C11.2 | U4.EPAD 16.26,26.92 U4.7 14.99,26.92 14.61,27.3 v14.61,27.81 | v11.43,34.42 IC1.EPAD v10.03,33.02 | U2.6 3.39,27.77 2.98,27.37 2.98,26.92 | 2.98,26.92 2.98,25.02 3.3,24.7 v4.38,24.7 5.21,24.7 5.58,25.07 U2.12
  Top 0.254: C13.2 v7.62,50.8 8.26,50.8 8.89,50.16 U3.PAD | U3.PAD 13.59,50.16 14.73,51.31 v16.51,51.31 | U3.8 U3.PAD | C8.2 19.05,24.96 v18.86,24.77
  Bottom 0.152: IC1.EPAD GND.1 | v7.62,38.73 7.62,39.44 7.64,39.46 7.64,43.08 7.95,43.38 9.96,43.38 10.16,43.18 v10.16,41.78
  other vias: 12.19,39.75 11.43,33.02 11.43,50.16 17.4,41.27 18.54,43.69 19.43,45.59 11.18,44.45 5.08,7.62 17.78,7.62 15.24,7.62 8.51,7.62 13.21,7.62 4.45,31.75 5.08,34.29 5.71,40.26 3.17,38.1 4.7,42.93 6.6,41.91 2.54,53.34 13.97,53.34 5.97,45.97 13.34,44.45 20.83,10.92 2.54,43.18 2.54,48.26 15.24,48.26 19.05,48.26 7.62,27.94 6.35,22.61 15.88,30.86 3.17,39.75 19.05,52.07 15.62,19.18 13.97,25.4 15.88,32.38 18.16,19.18 9.53,16.51 2.54,20.32 2.54,12.7 2.54,10.16 15.75,10.41 13.34,16.51 9.53,20.32 6.35,15.24 13.97,12.7 11.43,3.81 10.16,7.62 13.34,20.32 12.7,24.13 3.3,50.8 12.7,27.94 17.78,39.37 16.26,34.8 15.49,40.01 6.86,35.94 4.45,12.06 2.54,16.51 4.45,16.51 4.45,20.32
  pour Top (isolate 0.152, rank 3): 0,58.42 22.86,58.42 22.86,0 0,0
  pour Bottom (isolate 0.152, rank 2): 0,58.42 22.86,58.42 22.86,0 0,0
  pour Route2 (isolate 0.203, rank 2): 0,58.42 22.86,58.42 22.86,0 0,0
GPIO2  (via drill 0.3)
  Top 0.152: IC1.27 15.26,32.96 v15.26,33 | v11.3,41.78 R13.2
  Bottom 0.152: v15.26,33 13.99,33 10.54,36.45 10.54,41.02 v11.3,41.78 12.06,42.55 U6.5
GPIO4
  Top 0.152: IC1.29 14.82,34.29 16.64,34.29 R25.1
GPIO7  (via drill 0.3)
  Top 0.152: IC1.31 14.42,35.31 v14.86,35.31 | v11.3,40.77 R14.2
  Bottom 0.152: v14.86,35.31 14.73,35.18 12.28,35.18 10.82,36.63 10.82,40.29 v11.3,40.77 11.81,41.27 U6.6
GPIO10  (via drill 0.3)
  Top 0.152: IC1.21 13.16,29.87 v13.16,29.59
  Bottom 0.152: v13.16,29.59 13.16,30.02 12.7,30.48 GPIO10.1
MICROSD_CLK/SCK  (via drill 0.3)
  Top 0.152: U3.12 13.13,47.76 v13.13,47.3 | v2.31,22.48 3.43,22.48 5.84,24.89 9.16,24.89 | J2.5 v15.06,18.09 13.97,19.18 13.97,21.2 12.84,22.33 10.3,22.33 9.16,23.46 9.16,24.89 | 9.16,24.89 U5.9 | U4.10 16.01,24.9 v15.88,24.77
  Bottom 0.152: v2.31,22.48 2.56,22.73 2.56,34.82 5.87,38.13 5.91,38.13 7.36,39.58 7.36,43.29 7.74,43.66 11.66,43.66 12.32,44.32 12.32,46.49 v13.13,47.3 | v15.88,24.77 15.37,24.77 14.8,24.2 14.8,18.34 v15.06,18.09
MICROSD_CMD/SDI  (via drill 0.3)
  Top 0.152: U4.9 15.51,25.16 15.11,24.77 v14.48,24.77 13.72,24.77 13.34,25.15 13.34,28.07 12.45,28.96 10.92,28.96 10.66,28.69 U5.3 | J2.3 14.49,15.89 v14.48,15.88
  Bottom 0.152: v14.48,15.88 v14.48,24.77
MICROSD_D0/SDO
  Top 0.152: U4.2 17.51,28.3 17.65,28.45 18.92,28.45 19.68,27.69 19.68,20.95 19.02,20.29 J2.7 15.27,20.29 12.95,22.61 10.41,22.61 9.66,23.36 U5.10
MICROSD_D1  (via drill 0.3)
  Top 0.152: U5.2 11.16,28.3 11.33,28.48 v11.94,28.48 | v14,22.24 14.85,21.39 J2.8
  Bottom 0.152: v11.94,28.48 12.93,28.48 13.34,28.07 13.34,22.9 v14,22.24
MICROSD_D2  (via drill 0.3)
  Top 0.152: U2.3 v5.58,28.54 v5.59,28.55 | J2.1 15.52,13.69 v15.49,13.72
  Bottom 0.152: v5.59,28.55 5.05,28.02 5.05,18.29 8.93,14.41 14.8,14.41 v15.49,13.72
MICROSD_D3/!CS!  (via drill 0.3)
  Top 0.152: v6.35,28.55 6.08,28.28 U2.2 | v15.49,14.73 15.55,14.79 J2.2 18.98,14.79 v19.05,14.86 | U4.3 17.01,28.31 17.42,28.73 19.04,28.73 19.96,27.8 19.96,18.06 v19.68,17.78
  Bottom 0.152: v6.35,28.55 5.33,27.54 5.33,18.41 9.02,14.73 v15.49,14.73 | v19.68,17.78 19.68,15.49 v19.05,14.86
MICROSD_PWR_EN  (via drill 0.3)
  Top 0.152: U3.5 8.87,51.31 v8.64,51.31 | v21.59,6.99 21.59,7.36 21.27,7.69 | v19.05,30.35 19.94,31.24 19.94,39.94 19.25,40.63 16.52,40.63 v16.51,40.64
  Top 0.254: Q3.1 21.27,7.69 R9.1
  Bottom 0.152: v8.64,51.31 8.65,51.33 9.33,51.33 9.53,51.53 13.87,51.53 17.53,47.87 17.53,44.96 16.51,43.94 v16.51,40.64 | v21.59,6.99 21.59,11.43 20.38,12.64 20.38,29.91 19.94,30.35 v19.05,30.35
MICROSD_VCC
  Top 0.254: Q3.3 18.33,10.2 C5.1 19.06,12.7 19.81,13.45 19.81,16.38 19.21,16.99 J2.4
N$1
  Top 0.152: R11.2 6.74,3.81 8.89,3.81 10.18,5.1 J1.A5
N$2
  Top 0.152: R10.2 16.25,3.81 14.41,3.81 13.18,5.04 J1.B5
N$3
  Top 0.152: C3.1 6.85,32.26 7.99,31.11 8.82,31.11 IC1.13
N$4
  Top 0.152: IC1.34 13.11,36.11 13.11,37.11 11.47,38.74 C4.1
N$5
  Top 0.152: Q5.2 Q5.5 8.89,41.66 9.02,41.53 9.4,41.53 9.54,41.67 Q5.6 10.49,42.38 R21.2
N$9
  Bottom 0.152: JP1.1 J4.19
N$10
  Bottom 0.152: JP2.1 J4.20
N$11
  Bottom 0.152: JP3.1 J4.21
N$13
  Top 0.254: R22.2 7.94,43.68 Q5.3 8.24,44.93 Q4.1
N$14  (via drill 0.3)
  Top 0.152: R19.2 4.95,49.92 v4.95,50.29
  Bottom 0.152: I2C.3 5.26,49.99 v4.95,50.29
N$15
  Top 0.152: Q7.2 Q7.5 Q7.6 17.48,42.38 R23.2
N$16  (via drill 0.3)
  Top 0.152: R18.1 4.95,51.68 v4.95,51.31
  Bottom 0.152: I2C.1 3.63,49.99 v4.95,51.31
N$17
  Top 0.152: R7.1 8.57,40.19 Q1.1 8.57,38.41 8.26,38.1 6.73,38.1 6.15,37.52 Q2.3
N$18
  Top 0.152: D2.A R17.1
N$19  (via drill 0.3)
  Top 0.152: D2.C v16.51,57.78
  Bottom 0.152: LED2.2 16.38,57.66 v16.51,57.78
N$22
  Top 0.152: D1.A R8.1
N$23
  Top 0.152: IC1.35 12.7,36.41 12.7,37.12 11.68,38.14 10.29,38.14 10.16,38.27 R16.2
N$25
  Bottom 0.152: RXD.1 J4.14
N$26
  Bottom 0.152: TXD.1 J4.15
N$27  (via drill 0.3)
  Top 0.152: D1.C v6.35,57.78
  Bottom 0.152: v6.35,57.78 6.48,57.66 LED1.2
N$28
  Top 0.152: Q6.1 15.22,44.93 Q7.3 15.22,43.81 14.1,42.68 R24.2
PICO  (via drill 0.3)
  Top 0.152: v14.73,25.53 14.73,26.12 15.03,26.42 U4.8
  Bottom 0.152: J4.17 21.45,41.91 17.25,37.71 17.25,31.08 19.55,28.78 19.55,24.68 19.09,24.23 17.64,24.23 17.27,24.59 17.27,24.88 16.62,25.53 v14.73,25.53
POCI  (via drill 0.3)
  Top 0.152: U4.1 17.86,27.22 v18.41,27.77
  Bottom 0.152: J4.16 20.19,43.05 20.19,41.05 16.97,37.82 16.97,30.93 18.41,29.49 v18.41,27.77
RXD0  (via drill 0.3)
  Top 0.152: U3.3 9.62,51.98 v9.62,52.29
  Bottom 0.152: v9.62,52.29 9.77,52.29 9.86,52.2 14.22,52.2 16.89,49.53 RXD.2
SCL
  Top 0.152: R19.1 J4.2 | U3.1 11.43,52.85 J3.3
  Bottom 0.152: J4.2 2.54,50.8 2.54,52.26 3.14,52.86 8.93,52.86 10.68,54.61 J3.3
SCLK  (via drill 0.3)
  Top 0.152: v16.56,24.77 16.51,24.81 U4.11
  Bottom 0.152: J4.18 19.3,39.37 17.53,37.59 17.53,31.2 19.82,28.9 19.82,24.57 19.39,24.13 19.21,23.95 17.37,23.95 v16.56,24.77
SD_!CD!  (via drill 0.3)
  Top 0.152: v18.16,22.48 16.86,22.48 J2.9 | IC1.26 15.01,31.56 16.32,31.56 17.08,30.8 17.08,29.32 17.4,29.01 18.85,29.01 v19.68,29.84
  Bottom 0.152: v19.68,29.84 20.1,29.43 20.1,23.79 18.8,22.48 v18.16,22.48
SD_CLK  (via drill 0.3)
  Top 0.152: IC1.9 7.69,33.17 4.58,33.17 3.68,32.27 3.68,29.7 4.19,29.19 v4.54,29.19 | v8.38,25.65 8.38,26.12 8.68,26.42 U5.8
  Bottom 0.152: v4.54,29.19 4.94,29.59 6.6,29.59 7.14,29.06 7.14,26.64 8.13,25.65 v8.38,25.65
SD_CMD
  Top 0.152: IC1.11 8.04,31.75 7.87,31.75 6.73,32.89 4.7,32.89 3.96,32.16 3.96,30.45 4.83,29.59 9.61,29.59 10.16,29.04 U5.4
SD_D0  (via drill 0.3)
  Top 0.152: IC1.5 8.64,35.81 v8.26,35.81 | v8.26,35.81 | v10.16,24.77 U5.11
  Bottom 0.152: v8.26,35.81 7.78,35.81 7.14,35.18 7.14,30.07 7.89,29.32 7.89,28.49 8.33,28.05 8.59,28.05 9.21,27.43 9.21,25.08 9.53,24.77 v10.16,24.77
SD_D1  (via drill 0.3)
  Top 0.152: IC1.4 9.26,35.9 v9.26,35.93 | v11.94,27.69 11.94,27.09 11.76,26.92 U5.1
  Bottom 0.152: v9.26,35.93 8.62,35.29 7.75,35.29 7.49,35.04 7.49,30.55 8.17,29.88 8.17,28.61 8.45,28.33 11.3,28.33 v11.94,27.69
SD_D2  (via drill 0.3)
  Top 0.152: U2.4 5.08,28.78 5.59,29.29 9.25,29.29 9.33,29.21 v9.33,29.09 | v15.11,30.99 14.86,30.99 14.08,31.77 IC1.25
  Bottom 0.152: v15.11,30.99 14.22,30.99 13.97,30.73 13.97,30.23 14.35,29.84 14.35,29.21 14.18,29.04 12.45,29.04 12.18,29.31 10.06,29.31 9.84,29.09 v9.33,29.09
SD_D3  (via drill 0.3)
  Top 0.152: IC1.23 | v14.48,30.48 13.97,30.48 IC1.23 | v8.65,28.81 7.47,28.81 6.86,28.19 6.86,27.09 6.68,26.92 U2.1
  Bottom 0.152: v8.65,28.81 8.85,28.61 9.75,28.61 10.18,29.03 12.06,29.03 12.34,28.75 14.4,28.75 14.73,29.08 14.73,30.23 v14.48,30.48
SD_WP  (via drill 0.3)
  Top 0.152: IC1.30 14.65,34.82 v15.34,34.82
  Bottom 0.152: v15.34,34.82 14.81,34.29 SD_WP.1
SDA  (via drill 0.3)
  Top 0.152: J4.1 R18.2 4.83,53.34 v5.08,53.34 | J3.4 12.7,55.88 14.61,55.88 15.24,55.24 15.24,52.56 U3.16
  Bottom 0.152: v5.08,53.34 9.02,53.34 10.16,54.48 10.16,55.88 J3.4
SDIO_!RESET!  (via drill 0.3)
  Top 0.152: IC1.18 10.57,29.34 10.29,29.34 9.53,30.1 v8.76,30.1 6.36,30.1 R1.2 C16.1
  Bottom 0.152: v8.76,30.1 9.27,30.1 9.65,30.48 SDIO_!RESET!.1
SDIO_EN  (via drill 0.3)
  Top 0.152: U3.2 10.18,52.12 v10.18,52.81 | U2.5 v4.58,28.5 v4.57,28.51 4,28.51 3.25,29.26 3.25,36.39 R20.2 Q2.1 5.07,37.08 5.71,37.72 v5.71,38.61 | U5.12 10.66,25.03 v10.92,24.77 11.16,25 U5.13 | v8.38,27.57 8.59,27.77 U5.6 9.16,28.34 9.27,28.45 9.53,28.45 9.66,28.31 U5.5 | U2.13 6.77,25.57 v6.86,25.65
  Bottom 0.152: v10.18,52.81 9.29,52.81 8.98,52.5 7.18,52.5 6.63,51.95 6.63,43.46 5.08,41.91 5.08,39.37 5.71,38.73 v5.71,38.61 | v4.57,28.51 4.76,28.51 5.41,29.16 6.53,29.16 6.86,28.83 v6.86,25.65 6.86,25.27 7.85,24.29 8.89,24.29 | v10.92,24.77 10.44,24.29 8.89,24.29 | v8.38,27.57 8.89,27.06 8.89,24.29
SDIO_VDD  (via drill 0.3)
  Top 0.152: IC1.6 8.69,35.05 8.26,35.05 v8,34.8 | IC1.22 13.84,29.9 v13.84,29.59 14.99,29.59 C14.1 | IC1.36 12.19,36.61 12.19,37.21 11.81,37.59 v11.43,37.59 9.91,37.59 9.65,37.85 8.47,37.85 Q1.3 | R1.1 6.87,31.23 7.46,30.64 v8.1,30.64 9.04,30.64 IC1.14 | R13.1 13.07,41.55 R14.1 13.09,40.75 C19.1 v13.08,38.73
  Top 0.254: Q1.3 7.62,35.69 7.37,35.43 | 7.37,35.43 v8,34.8 | C15.1 6.99,35.05 7.37,35.43
  Bottom 0.152: v13.84,29.59 13.84,29.84 12.57,31.11 10.79,31.11 SDIO_VDD.1 9.04,30.64 v8.1,30.64 7.85,30.89 7.85,34.64 v8,34.8 | U6.8 v13.08,38.73 11.94,37.59 v11.43,37.59
SPI_EN  (via drill 0.3)
  Top 0.152: U3.11 12.57,47.61 12.57,44.45 13.34,43.69 13.34,42.04 14.58,40.8 15.59,40.8 16.23,40.16 19.26,40.16 19.6,39.83 19.6,31.6 v17.59,29.59 | R15.2 13.97,27.94 14.61,28.57 v15.75,28.57 | U4.5 16.01,28.31 v15.75,28.57 | U4.13 17.51,25.16 v17.91,24.77 17.4,24.77 17.01,25.15 U4.12 | U4.6 15.51,28.34 v15.75,28.57
  Bottom 0.152: v15.75,28.57 15.75,27.88 | 15.75,27.88 15.75,26.92 v17.91,24.77 | v17.59,29.59 17.59,28.7 16.76,27.88 15.75,27.88
TXD0  (via drill 0.3)
  Top 0.152: U3.4 9.13,51.75 v9.13,51.8
  Bottom 0.152: v9.13,51.8 14.11,51.8 18.64,47.27 TXD.2
V_USB
  Top 0.254: 2.54,39.24 2.54,40.67 U1.1 3.75,43.12 4.19,43.56 5.21,43.56 5.65,43.12 U1.3 | 9.14,9.78 4.19,9.78 1.78,12.19 1.78,22.73 2.54,23.5 2.54,39.24 | 9.14,9.78 13.08,9.78 13.88,8.98 J1.VBUS2 | 9.14,9.78 9.14,6.49 J1.VBUS1 | 2.54,39.24 2.6,39.18 R2.2 C6.1
V_USB_DIV_2  (via drill 0.3)
  Top 0.152: R3.2 R2.1 5.26,39.5 v5.71,39.5 | U3.14 13.53,48.77 v13.97,48.77
  Bottom 0.152: v13.97,48.77 13.97,48.22 13.53,47.78 12.88,47.78 11.97,46.86 11.97,44.49 11.42,43.94 7.62,43.94 7.08,43.41 7.08,40.61 5.97,39.5 v5.71,39.5
VCC  (via drill 0.3)
  Top 0.254: R8.2 6.35,51.36 v5.79,50.8 5.71,50.73 5.71,49.78 6.47,49.03 R4.2 C13.1 8.37,49.03 v8.7,48.7 9.27,48.13 10.11,48.13 U3.9 | Q1.2 6.67,40.19 R7.2 | Q5.4 8.24,42.25 7.12,41.13 R7.2 | v9.78,46.23 9.84,46.17 Q4.2 | C18.1 16.83,45.22 Q6.2 16.82,46.17 v16.76,46.23 | v15.49,41.4 15.22,41.67 Q7.4 | R9.2 20.88,9.14 Q3.2 20.37,9.53 v19.3,9.53 | U2.14 7.37,26.42 C11.1 v7.62,25.4 | v12.7,25.4 C9.1 12.45,26.42 U5.14 | 18.92,27.17 C8.1 18.41,26.54 18.41,26.42 | 18.41,26.42 v18.41,25.46 | U4.14 18.41,26.42 | R7.2 v6.35,40.64
  Bottom 0.152: I2C.2 v4.45,48.26
  pour Route15 (isolate 0.203): 0,0 0,58.42 22.86,58.42 22.86,0
VCC_1
  Top 0.254: U1.5 3.75,45.78 C7.1 3.94,45.98 3.94,46.48 4.78,47.33 Q4.3 | Q4.3 10.32,47.33 C1.1 | Q5.1 9.54,44.31 8.89,44.96 Q4.3
XTAL1
  Top 0.152: IC1.33 14.38,36.68 R12.2 14.38,38.4 C12.2 14.9,39.03 Y1.3
XTAL2
  Top 0.152: IC1.32 14.76,36.35 R12.1 16.43,36.35 C17.2 16.48,36.68 16.76,36.95 Y1.1

### Text on the board
Bottom: v10
Measures: Dimensions in Inches
tDocu: 4-Layer Board / 1.6mm Thickness / 1oz Copper (Outer layers) / HASL Finish | Paul Clark